# EAGLE design touch-sensor (EAGLE 5.09)
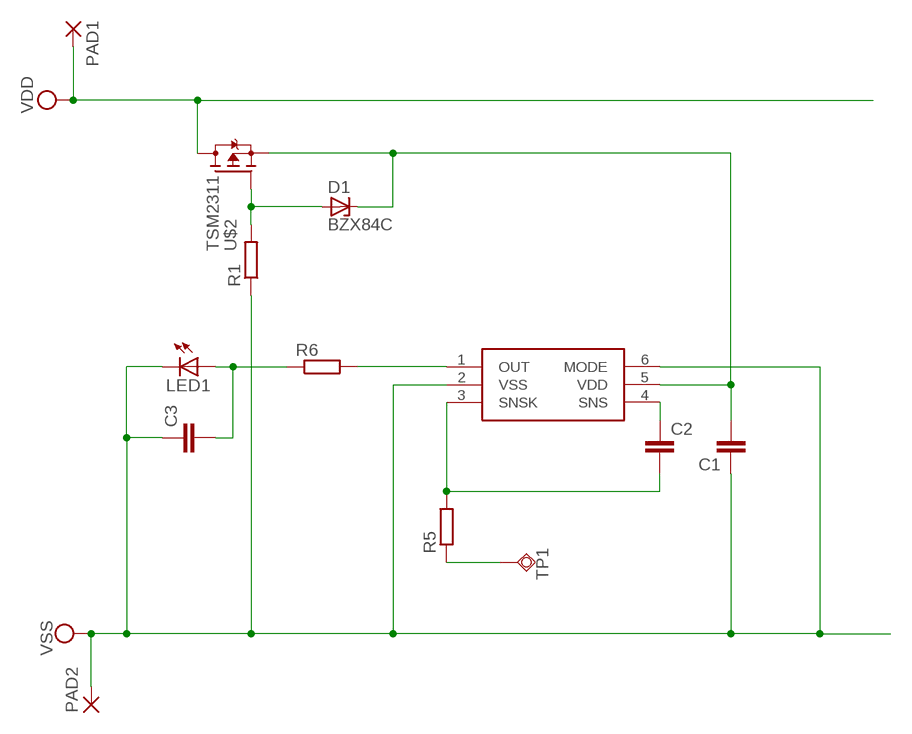
[diagram p0: schematic, sheet 1]

## Parts
C1  C-EUC0603  [C0603]
C2  C-EUC0603  [C0603]
C3  C-EUC0603  [C0603]
D1  BZX84C  [SOT23]
LED1  LEDCHIPLED_0603  [CHIPLED_0603]
PAD1  3,81/1,3  [3,81/1,3]
PAD2  3,81/1,3  [3,81/1,3]
R1  R-EU_R0603  [R0603]
R5  R-EU_R0603  [R0603]
R6  R-EU_R0603  [R0603]
TP1  TPSQTP20SQ  [TP20SQ]
U$1  AT42QT1011  [SOT23-6]
U$2  TSM2311  [SOT23]

## Nets
N$1: C1.2 D1.3(C) U$1.5(VDD) U$2.2(S)
N$2: D1.1(A) R1.2 U$2.1(G)
N$4: C2.1 U$1.4(SNS)
N$5: C2.2 R5.2 U$1.3(SNSK)
N$6: R6.2 U$1.1(OUT)
N$7: C3.2 LED1.A R6.1
N$10: R5.1 TP1.TP
VDD: PAD1.1(P) U$2.3(D)
VSS: C1.1 C3.1 LED1.C PAD2.1(P) R1.1 U$1.2(VSS) U$1.6(MODE)

## Library data of the parts
C1-C3 = resistor:C-EU: CAPACITOR, European symbol
D1 = __SR:BZX84C: Z DIODE
LED1 = led:LED: LED OSRAM: - CHIPLED LG R971, LG N971, LY N971, LG Q971, LY Q971, LO R971, LY R971 LH N974, LH R974 LS Q976, LO Q976, LY Q976 LO Q996 - Hyper CHIPLED LW Q18S LB Q993, LB Q99A, LB R99A - SideLED LS A670, LO A670, LY A670, LG A670, LP A670 LB A673, LV A673, LT A673, LW A673 LH A674 LY A675 LS A676, LA A676, LO A676, LY A676, LW A676 LS A679, LY A679, LG A679 - Hyper Micro SIDELED® LS Y876, LA Y876, LO Y876, LY Y876 LT Y87S - SmartLED LW L88C, LW L88S LB L89C, LB L89S, LG L890 LS L89K, LO L89K, LY L89K LS L896, LA L896, LO L896, LY L896 - TOPLED LS T670, LO T670, LY T670, LG T670, LP T670 LSG T670, LSP T670, LSY T670, LOP T670, LYG T670 LG T671, LOG T671, LSG T671 LB T673, LV T673, LT T673, LW T673 LH T674 LS T676, LA T676, LO T676, LY T676, LB T676, LH T676, LSB T676, LW T676 LB T67C, LV T67C, LT T67C, LS T67K, LO T67K, LY T67K, LW E67C LS E67B, LA E67B, LO E67B, LY E67B, LB E67C, LV E67C, LT E67C LW T67C LS T679, LY T679, LG T679 LS T770, LO T770, LY T770, LG T770, LP T770 LB T773, LV T773, LT T773, LW T773 LH T774 LS E675, LA E675, LY E675, LS T675 LS T776, LA T776, LO T776, LY T776, LB T776 LHGB T686 LT T68C, LB T68C - Hyper Mini TOPLED® LB M676 - Mini TOPLED Santana® LG M470 LS M47K, LO M47K, LY M47K Source: http://www.osram.convergy.de LUXEON: - LUMILED® LXK2-PW12-R00, LXK2-PW12-S00, LXK2-PW14-U00, LXK2-PW14-V00 LXK2-PM12-R00, LXK2-PM12-S00, LXK2-PM14-U00 LXK2-PE12-Q00, LXK2-PE12-R00, LXK2-PE12-S00, LXK2-PE14-T00, LXK2-PE14-U00 LXK2-PB12-K00, LXK2-PB12-L00, LXK2-PB12-M00, LXK2-PB14-N00, LXK2-PB14-P00, LXK2-PB14-Q00 LXK2-PR12-L00, LXK2-PR12-M00, LXK2-PR14-Q00, LXK2-PR14-R00 LXK2-PD12-Q00, LXK2-PD12-R00, LXK2-PD12-S00 LXK2-PH12-R00, LXK2-PH12-S00 LXK2-PL12-P00, LXK2-PL12-Q00, LXK2-PL12-R00 Source: www.luxeon.com KINGBRIGHT: KA-3528ASYC Source: www.kingbright.com
PAD1 PAD2 = wirepad:3,81/1,3: THROUGH-HOLE PAD
R1 R5 R6 = resistor:R-EU_: RESISTOR, European symbol
TP1 = testpad:TPSQ: Test pad
U$1 = __SR:AT42QT1011
U$2 = __SR:TSM2311

## Board
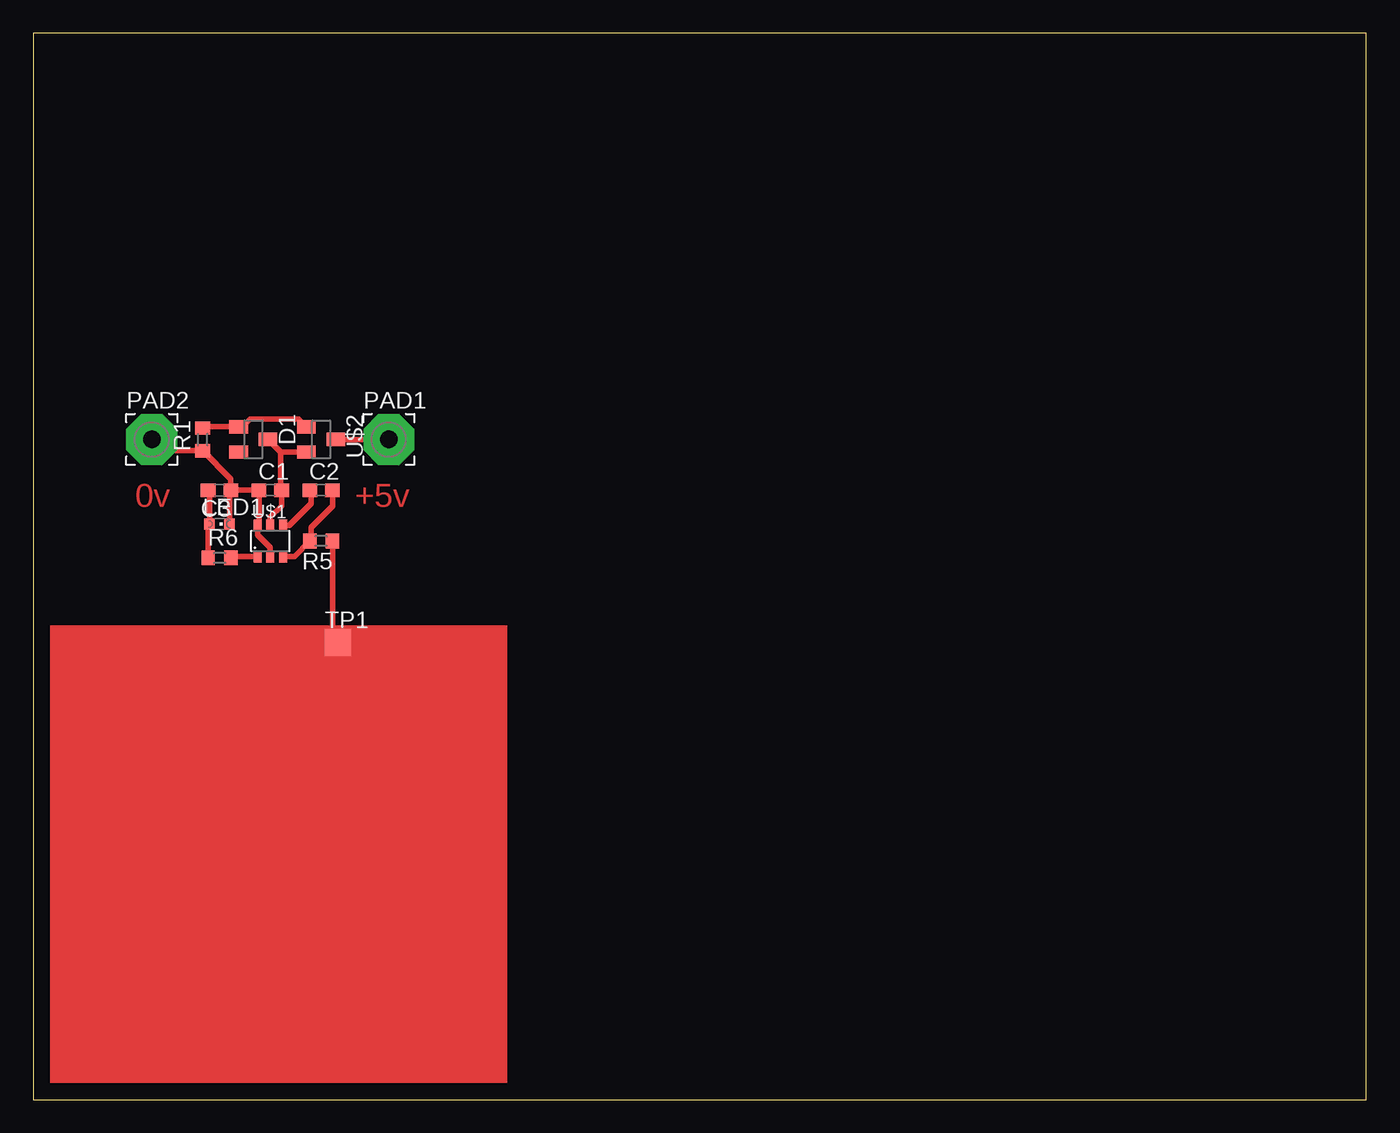
[diagram p1: board, top side]

Size 100 x 80 mm. Coordinates in mm from the lower left corner, seen from the top.
Outline: 0,0 100,0 100,80 0,80 0,0
Copper layers (1*16): Top 0.035mm / dielectric 1.5mm / Bottom 0.035mm
Design rules "default": minimum track width 10mil, minimum drill 24mil, track to track 8mil, track to pad 8mil, pad to pad 8mil, via to via 8mil, smd to smd 8mil, copper to edge 40mil, drill to drill 8mil, minimum pad ring 10mil, minimum via ring 8mil, stop-mask expansion 4mil, vias tented up to drill 0mil, thermal gap 10mil

### Footprints (pad centres in the part's own frame; a part is rotated, then mirrored left to right if it is on the bottom)
C0603 = smd 1.1 x 1: 1 -0.85,0; 2 0.85,0
SOT23 = smd 1 x 1.4: 1 -0.95,-1.1; 2 0.95,-1.1; 3 0,1.1
CHIPLED_0603 = smd 0.8 x 0.8: A 0,-0.75; C 0,0.75
3,81/1,3 = drill 1.321 pad 3.81 octagon: 1 0,0
R0603 = smd 1 x 1.1: 1 -0.85,0; 2 0.85,0
TP20SQ = smd 2 x 2: TP 0,0
SOT23-6 = smd 0.6 x 0.9: 1 -0.95,-1.15; 2 0,-1.15; 3 0.95,-1.15; 4 0.95,1.15; 5 0,1.15; 6 -0.95,1.15

### Placement (x,y rotation side)
C1  17.78,45.72 0 top
C2  21.59,45.72 0 top
C3  13.97,45.72 180 top
D1  16.51,49.53 270 top
LED1  13.97,43.18 270 top
PAD1  26.67,49.53 0 top
PAD2  8.89,49.53 0 top
R1  12.7,49.53 90 top
R5  21.59,41.91 180 top
R6  13.97,40.64 0 top
TP1  22.86,34.29 0 top
U$1  17.78,41.91 0 top
U$2  21.59,49.53 270 top

### Tracks (layer width: path | path; a pad name or v marks a point on that pad's centre or on a via)
N$1
  Top 0.406: U$1.5 17.78,43.69 18.63,44.54 C1.2 18.56,45.79 18.56,48.58 | 18.56,48.58 D1.3 | 18.56,48.58 U$2.2
N$2
  Top 0.406: U$2.1 19.92,51.05 16.26,51.05 15.68,50.48 D1.1 12.8,50.48 R1.2
N$4
  Top 0.406: U$1.4 19.18,43.06 20.83,44.7 20.83,45.63 C2.1
N$5
  Top 0.406: C2.2 22.44,44.54 20.83,42.93 20.83,42 R5.2 19.59,40.76 U$1.3
N$6
  Top 0.406: R6.2 14.94,40.76 U$1.1
N$7
  Top 0.406: C3.2 13.22,45.62 LED1.A 13.12,43.08 R6.1
N$10
  Top 0.406: R5.1 22.44,34.71 TP1.TP
VDD
  Top 0.406: U$2.3 PAD1.1
VSS
  Top 0.406: U$1.2 17.78,41.4 16.83,42.35 U$1.6 16.93,43.16 C1.1 C3.1 | C3.1 14.72,45.62 LED1.C | PAD2.1 9.74,48.68 R1.1 14.82,46.56 C3.1
(copper drawn outside any net)
  shapes: Top area x1

### Text on the board
Top: 0v | +5v